# Altium project voltagemeter.PrjPCB
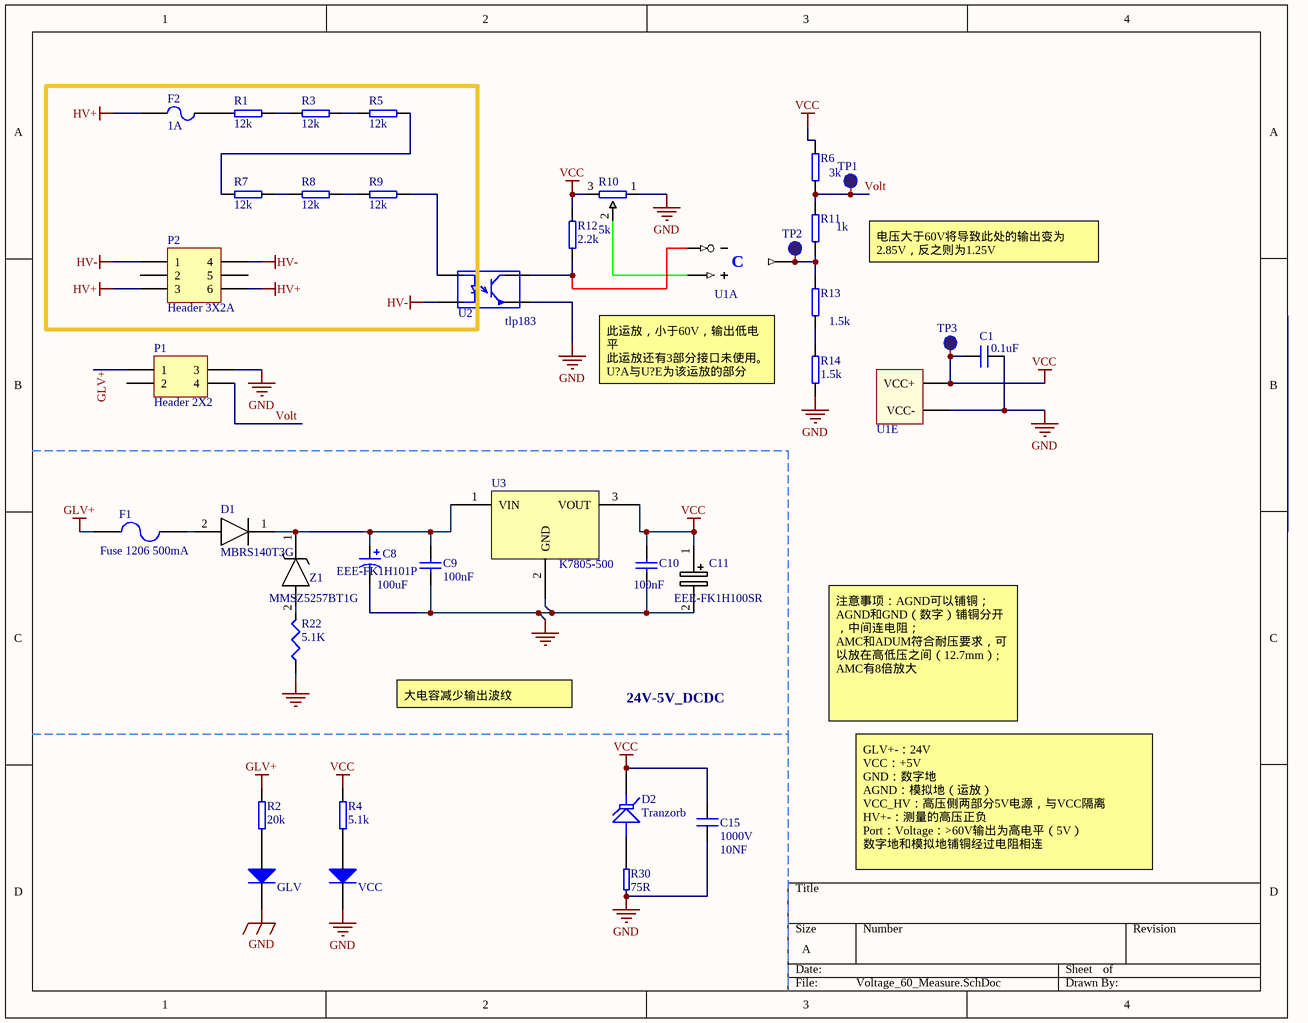
[diagram p0: Voltage_60_Measure.SchDoc]
1 sheet, 37 parts. Net scope: global (net labels, ports and power ports of the same name join across sheets).
Board file: voltage.PcbDoc

## Sheet Voltage_60_Measure.SchDoc
size A

### Parts
C1  value 0.1uF  [C0603]  (hidden comment: VJ0603Y104KXAAC)
C8  EEE-FK1H101P  value 100uF  [C-RB-SD8]
C9  value 100nF  [C1206]  (hidden comment: Cap Semi)
C10  value 100nF  [C1206]  (hidden comment: Cap Semi)
C11  EEE-FK1H100SR  [CAPAE430X610N]
C15  value 10NF  Voltage: 1000V  [C1206]  (hidden comment: VJ1206A102JXGAT5Z)
D1  MBRS140T3G  [DIOM5436X247N]
D2  Tranzorb  [SOD123]
F1  Fuse 1206 500mA  [1206]
F2  value 1A  [0485500DR]  (hidden comment: 0485500.DR)
GLV  VLMB1310-GS08  [BlueLED 0603]  (value not drawn)
P1  Header 2X2  [PHB2*2]
P2  Header 3X2A  [43045-0612]
R1  value 12k  [R2512]  (hidden comment: PHP02512E2001BST5)
R2  value 20k  [R0603]  (hidden comment: CRCW060320K0FKEAC)
R3  value 12k  [R2512]  (hidden comment: PHP02512E2001BST5)
R4  value 5.1k  [R0603]  (hidden comment: CRCW06035K10JNEAC)
R5  value 12k  [R2512]  (hidden comment: PHP02512E2001BST5)
R6  value 3k  [R0603]  (hidden comment: CRCW06031K50FKEAC)
R7  value 12k  [R2512]  (hidden comment: PHP02512E2001BST5)
R8  value 12k  [R2512]  (hidden comment: PHP02512E2001BST5)
R9  value 12k  [R2512]  (hidden comment: PHP02512E2001BST5)
R10  value 5k  [3362p]  (hidden comment: 3362P-1-502LF)
R11  value 1k  [R0603]  (hidden comment: CRCW06031K00JNEAC)
R12  value 2.2k  [R0603]  (hidden comment: CRCW06032K20JNEAC)
R13  value 1.5k  [R0603]  (hidden comment: CRCW06031K50FKEAC)
R14  value 1.5k  [R0603]  (hidden comment: CRCW06031K00JNEAC)
R22  value 5.1K  [0805-2]  (hidden comment: Res3)
R30  value 75R  [R 0603]  (hidden comment: R)
TP1  TP  [TP]  (value not drawn)
TP2  TP  [TP]  (value not drawn)
TP3  TP  [TP]  (value not drawn)
U1  TSX3704IDT  [SO-14]  (value not drawn)  (parts A,E of 5)
U2  tlp183  [SOP-4]
U3  K7805-500  [K7805-500R3]
VCC  VLMB1310-GS08  [BlueLED 0603]  (value not drawn)
Z1  MMSZ5257BT1G  [SOD3716X135N]

### Nets
GLV+: F1.1 P1.1 R2.2
GND: C1.1 C8.2 C9.1 C10.1 C11.2(-) C15.2 GLV.C P1.3 R10.1(CCW) R14.1 R22.1 R30.2 U1.12(VCC-) U2.3(E) U3.2(GND) VCC.C
HV+: F2.2 P2.3 P2.6
HV-: P2.1 P2.4 U2.2(C)
VCC: C1.2 C10.2 C11.1(+) C15.1 D2.2(K) R4.2 R6.2 R10.3(CW) R12.2 TP3.0 U1.3(VCC+) U3.3(VOUT)
Volt: P1.4 R6.1 R11.2 TP1.0
NetC8_1: C8.1 C9.2 D1.1(K) U3.1(VIN) Z1.1(K)
NetD1_2: D1.2(A) F1.2
NetD2_1: D2.1(A) R30.1
NetF2_1: F2.1 R1.2
NetGLV_A: GLV.A R2.1
NetR1_1: R1.1 R3.2
NetR3_1: R3.1 R5.2
NetR4_1: R4.1 VCC.A
NetR5_1: R5.1 R7.2
NetR7_1: R7.1 R8.2
NetR8_1: R8.1 R9.2
NetR9_1: R9.1 U2.1(A)
NetR10_2: R10.2(WIPER) U1.5(IN+)
NetR11_1: R11.1 R13.2 TP2.0 U1.2(OUT)
NetR12_1: R12.1 U1.4(IN-) U2.4(C)
NetR13_1: R13.1 R14.2
NetR22_2: R22.2 Z1.2(A)

Not connected (* = marked no-connect by the designer): P1 2; P2 2 5

### Notes on the sheet
- 电压大于60V将导致此处的输出变为2.85V，反之则为1.25V
- 此运放，小于60V，输出低电平
  此运放还有3部分接口未使用。
  U?A与U?E为该运放的部分
- 大电容减少输出波纹
- 24V-5V_DCDC
- 注意事项：AGND可以铺铜；
  AGND和GND（数字）铺铜分开，中间连电阻；
  AMC和ADUM符合耐压要求，可以放在高低压之间（12.7mm）;
  AMC有8倍放大
- GLV+-：24V
  VCC：+5V
  GND：数字地
  AGND：模拟地（运放）
  VCC_HV：高压侧两部分5V电源，与VCC隔离
  HV+-：测量的高压正负
  Port：Voltage：>60V输出为高电平（5V）
  数字地和模拟地铺铜经过电阻相连
- (in symbol TSX3704IDT, part A) C

### Library data of the parts
C1 = VJ0603Y104KXAAC: 多层陶瓷电容器MLCC - SMD/SMT 0603 .1uF 50volts X7R 10%; Manufacturer: Vishay; Voltage: 50V; ComponentLink1Description: Datasheet; ComponentLink1URL: https://eu.mouser.com/datasheet/2/427/vjcommercialseries-222796.pdf; Weight: 0.002
C8 = Cap Pol1: Polarized Capacitor (Radial); Published: 8-Jun-2000; LatestRevisionDate: 17-Jul-2002; LatestRevisionNote: Re-released for DXP Platform.; PackageReference: RB7.6-15; Publisher: Altium Limited; PackageDescription: Polarized Capacitor (Radial); 2 Leads
C9 C10 = Cap Semi: Capacitor (Semiconductor SIM Model); Published: 8-Jun-2000; LatestRevisionDate: 29-May-2009; LatestRevisionNote: IPC-7351 Footprint Added.; PackageReference: C1206; Publisher: Altium Limited; PackageDescription: Chip Capacitor
C11 = EEE-FK1H100SR: Capacitor Polarised; Manufacturer_Name: Panasonic; Datasheet Link: https://industrial.panasonic.com/cdbs/www-data/pdf/RDE0000/ABA0000C1251.pdf; Height: 6.1mm; Manufacturer_Part_Number: EEE-FK1H100SR; Mouser Part Number: 667-EEE-FK1H100SR; Mouser Price/Stock: https://www.mouser.com/Search/Refine.aspx?Keyword=667-EEE-FK1H100SR
C15 = VJ1206A102JXGAT5Z: 多层陶瓷电容器MLCC - SMD/SMT 1206 1000pF 1KV C0G 5%; Manufacturer: Vishay; ComponentLink1Description: Datasheet; ComponentLink1URL: https://eu.mouser.com/datasheet/2/427/vjcommercialseries-222796.pdf; Weight: 0.0162
D1 = MBRS140T3G: Diode; Manufacturer_Name: ON Semiconductor; Allied_Number: 70099505; Datasheet Link: http://www.onsemi.com/pub/Collateral/MBRS140T3-D.PDF; Height: 2.47mm; Manufacturer_Part_Number: MBRS140T3G; Mouser Part Number: 863-MBRS140T3G; Mouser Price/Stock: https://www.mouser.com/Search/Refine.aspx?Keyword=863-MBRS140T3G; RS Part Number: 5452074P; RS Price/Stock: http://uk.rs-online.com/web/p/products/5452074P; Allied Price/Stock: http://www.alliedelec.com/on-semiconductor-mbrs140t3g/70099505/
D2 = Tranzorb: Transient Voltage Suppression (TVS) Diode; Published: 24-Mar-1999; LatestRevisionDate: 17-Jul-2002; LatestRevisionNote: Re-released for DXP Platform.; PackageReference: DO-7; Publisher: Altium Limited; PackageDescription: Axial Lead Diode
F1 = Fuse 2: littelfuse 0437 .500; Published: 8-Jun-2000; LatestRevisionDate: 17-Jul-2002; LatestRevisionNote: Re-released for DXP Platform.; PackageReference: PIN-W2/E2.8; Publisher: Altium Limited; PackageDescription: Thru-Hole; 2 Leads
F2 = 0485500.DR: Fast-Acting 485 Series; Manufacturer: Littefuse; ComponentLink1Description: Datasheet; ComponentLink1URL: https://datasheet.octopart.com/0485.500DR-Littelfuse-datasheet-21204217.pdf
GLV VCC = VLMB1310-GS08: 标准LED-SMD Blue Clear Non-Diff; Manufacturer: Vishay; ComponentLink1Description: Datasheet; ComponentLink1URL: https://www.mouser.cn/datasheet/2/427/vlmo1300-241412.pdf; Color: Blue
P1 = Header 2X2: Header, 2-Pin, Dual row; LatestRevisionDate: 17-Jul-2002; LatestRevisionNote: Re-released for DXP Platform.; Publisher: Altium Limited
P2 = Header 3X2A: Header, 3-Pin, Dual row; LatestRevisionDate: 17-Jul-2002; LatestRevisionNote: Re-released for DXP Platform.; Publisher: Altium Limited
R1 R3 R5 R7-R9 = PHP02512E2001BST5: Thin Film Resistors - SMD 2.5watt 2Kohms .1% 25 PPM; Manufacturer: Vishay; Voltage: 200V; Power: 2.5W; ComponentLink1Description: Datasheet; ComponentLink1URL: https://eu.mouser.com/datasheet/2/427/php-73510.pdf; Weight: 0.00405
R2 = CRCW060320K0FKEAC: Thick Film Resistors - SMD 1/10Watt 20Kohms 1% Commercial Use; Manufacturer: Vishay; Voltage: 75V; ComponentLink1Description: Datasheet; ComponentLink1URL: https://eu.mouser.com/datasheet/2/427/crcwce3-1223726.pdf
R4 = CRCW06035K10JNEAC: Thick Film Resistors - SMD 1/10Watt 5.1Kohms 1% Commercial Use; Manufacturer: Vishay; ComponentLink1Description: Datasheet; ComponentLink1URL: https://eu.mouser.com/datasheet/2/427/crcwce3-1223726.pdf
R6 R13 = CRCW06031K50FKEAC: Thick Film Resistors - SMD 1/10Watt 1.5Kohms 1% Commercial Use; Manufacturer: Vishay; ComponentLink1Description: Datasheet; ComponentLink1URL: https://eu.mouser.com/datasheet/2/427/crcwce3-1223726.pdf
R10 = 3362P-1-502LF: Trimmer Resistors - Through Hole 1/4"SQ 5KOHMS 10% 0.5WATTS; Manufacturer: Bourns; ComponentLink1Description: Datasheet; ComponentLink1URL: https://eu.mouser.com/datasheet/2/54/362-776956.pdf; Weight: 0.567
R11 R14 = CRCW06031K00JNEAC: Thick Film Resistors - SMD 1/10Watt 1Kohms 5% Commercial Use; Manufacturer: Vishay; Voltage: 75V; Power: 0.1W; ComponentLink1Description: Datasheet; ComponentLink1URL: https://eu.mouser.com/datasheet/2/427/crcwce3-1223726.pdf
R12 = CRCW06032K20JNEAC: Thick Film Resistors - SMD 1/10Watt 2.2Kohms 1% Commercial Use; Manufacturer: Vishay; Voltage: 75V; ComponentLink1Description: Datasheet; ComponentLink1URL: https://eu.mouser.com/datasheet/2/427/crcwce3-1223726.pdf
R22 = Res3: Resistor; Published: 8-Jun-2000; LatestRevisionDate: 29-May-2009; LatestRevisionNote: IPC-7351 Footprint Added.; PackageReference: J1-0603; Publisher: Altium Limited; PackageDescription: Chip Resistor
U1 = TSX3704IDT: Analog Comparators Micropower (5uA) 16V quad CMOS comparator, push pull output; Manufacturer: ST; ComponentLink1Description: Datasheet; ComponentLink1URL: https://eu.mouser.com/datasheet/2/389/tsx3704-957487.pdf; Weight: 0.2592
U2 = VOMA617A-X001T: Transistor Output Optocouplers 80V Vceo; 3750 Vrms SOP-4; 50-600 CTR; ComponentLink1Description: Datasheet; ComponentLink1URL: https://eu.mouser.com/datasheet/2/427/voma617a-1314950.pdf
Z1 = MMSZ5257BT1G: Zener Diode; Manufacturer_Name: ON Semiconductor; Datasheet Link: http://www.onsemi.com/pub/Collateral/MMSZ5221BT1-D.PDF; Height: 1.35mm; Manufacturer_Part_Number: MMSZ5257BT1G; Mouser Part Number: 863-MMSZ5257BT1G; Mouser Price/Stock: https://www.mouser.com/Search/Refine.aspx?Keyword=863-MMSZ5257BT1G; RS Part Number: 6547482; RS Price/Stock: http://uk.rs-online.com/web/p/products/6547482